# EAGLE board RK05ex6x10 (EAGLE 6.6.0), part 1 of 2
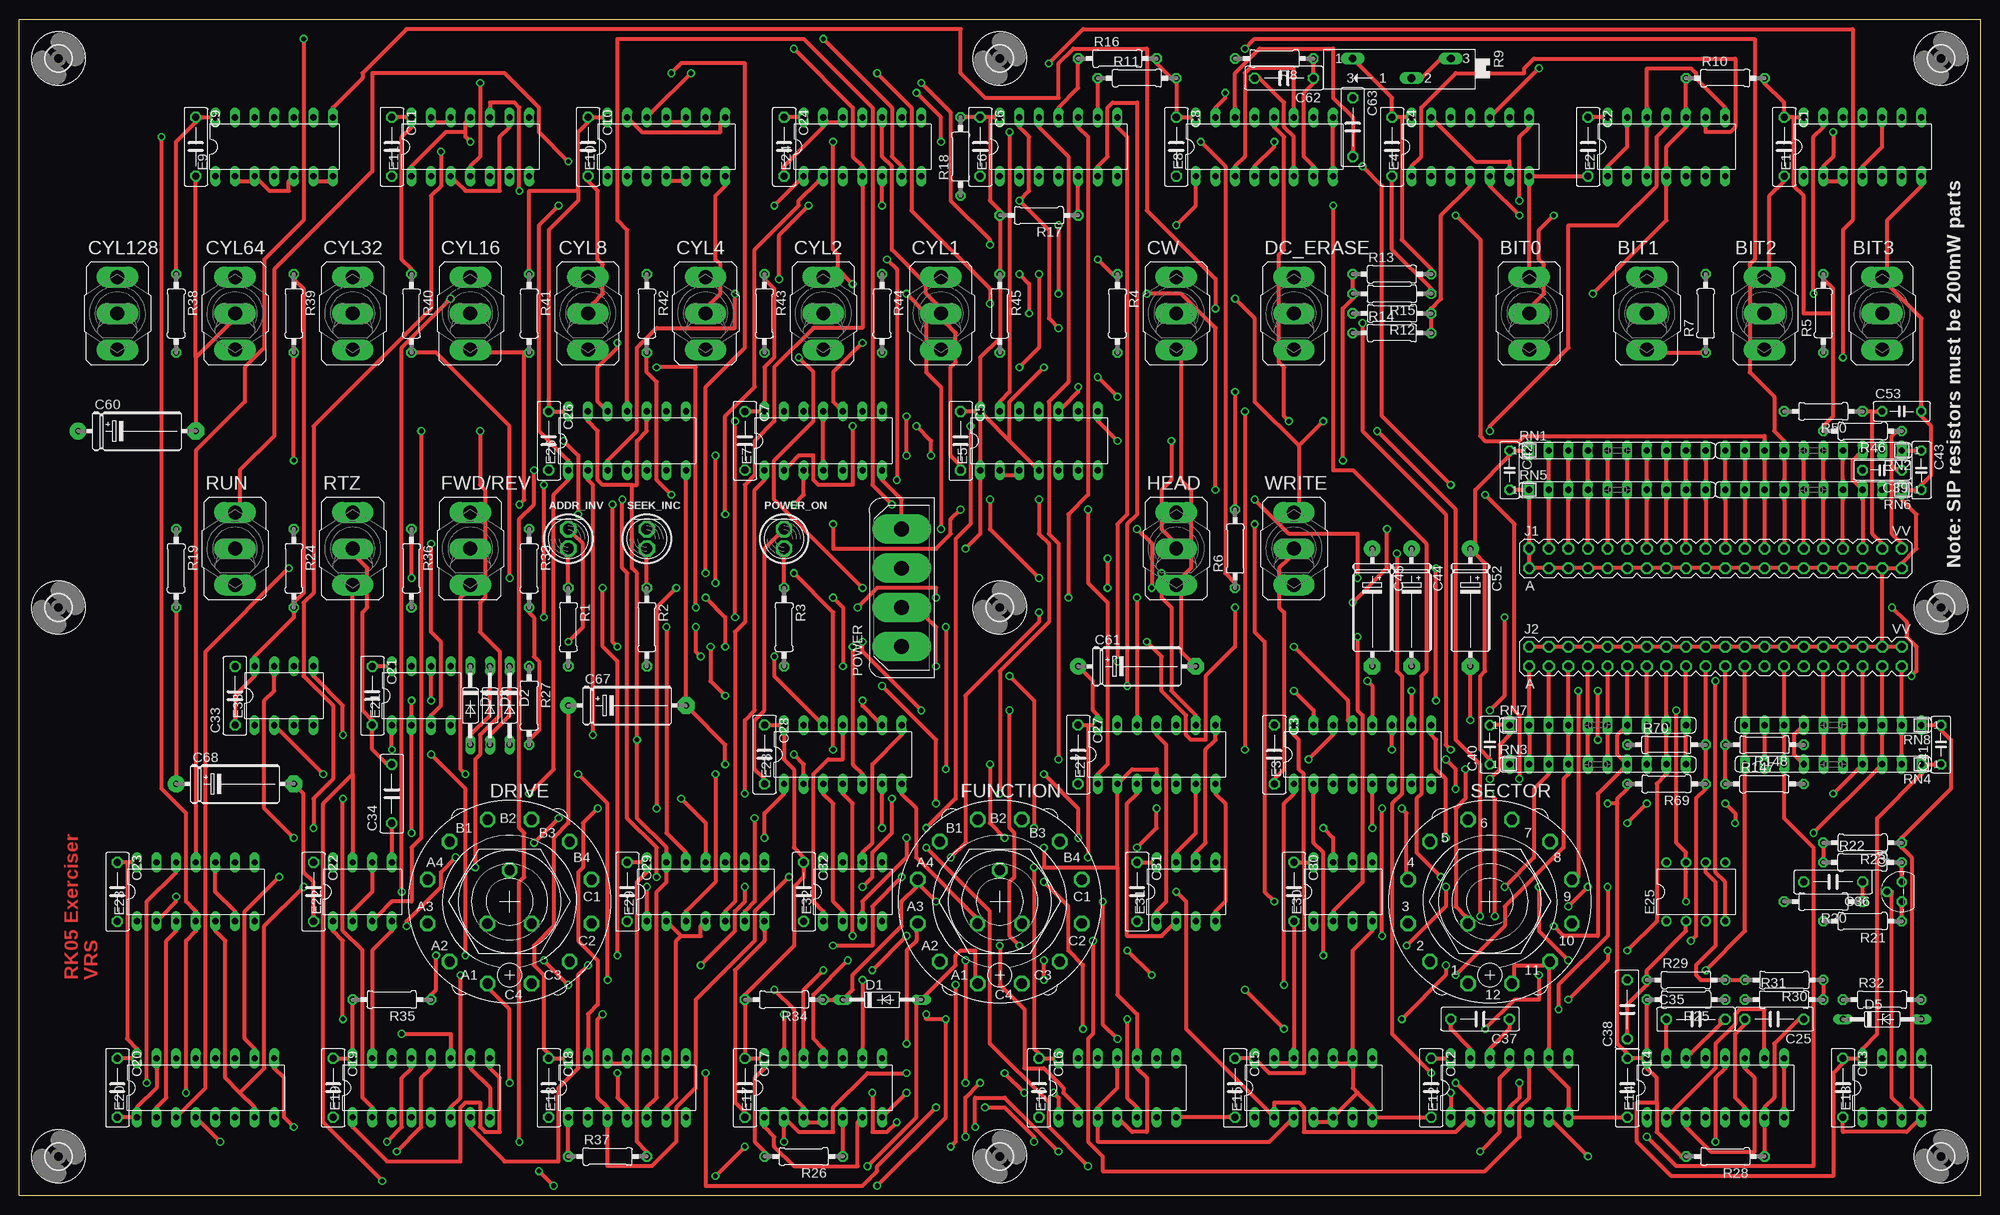
[diagram p5: board, top side]
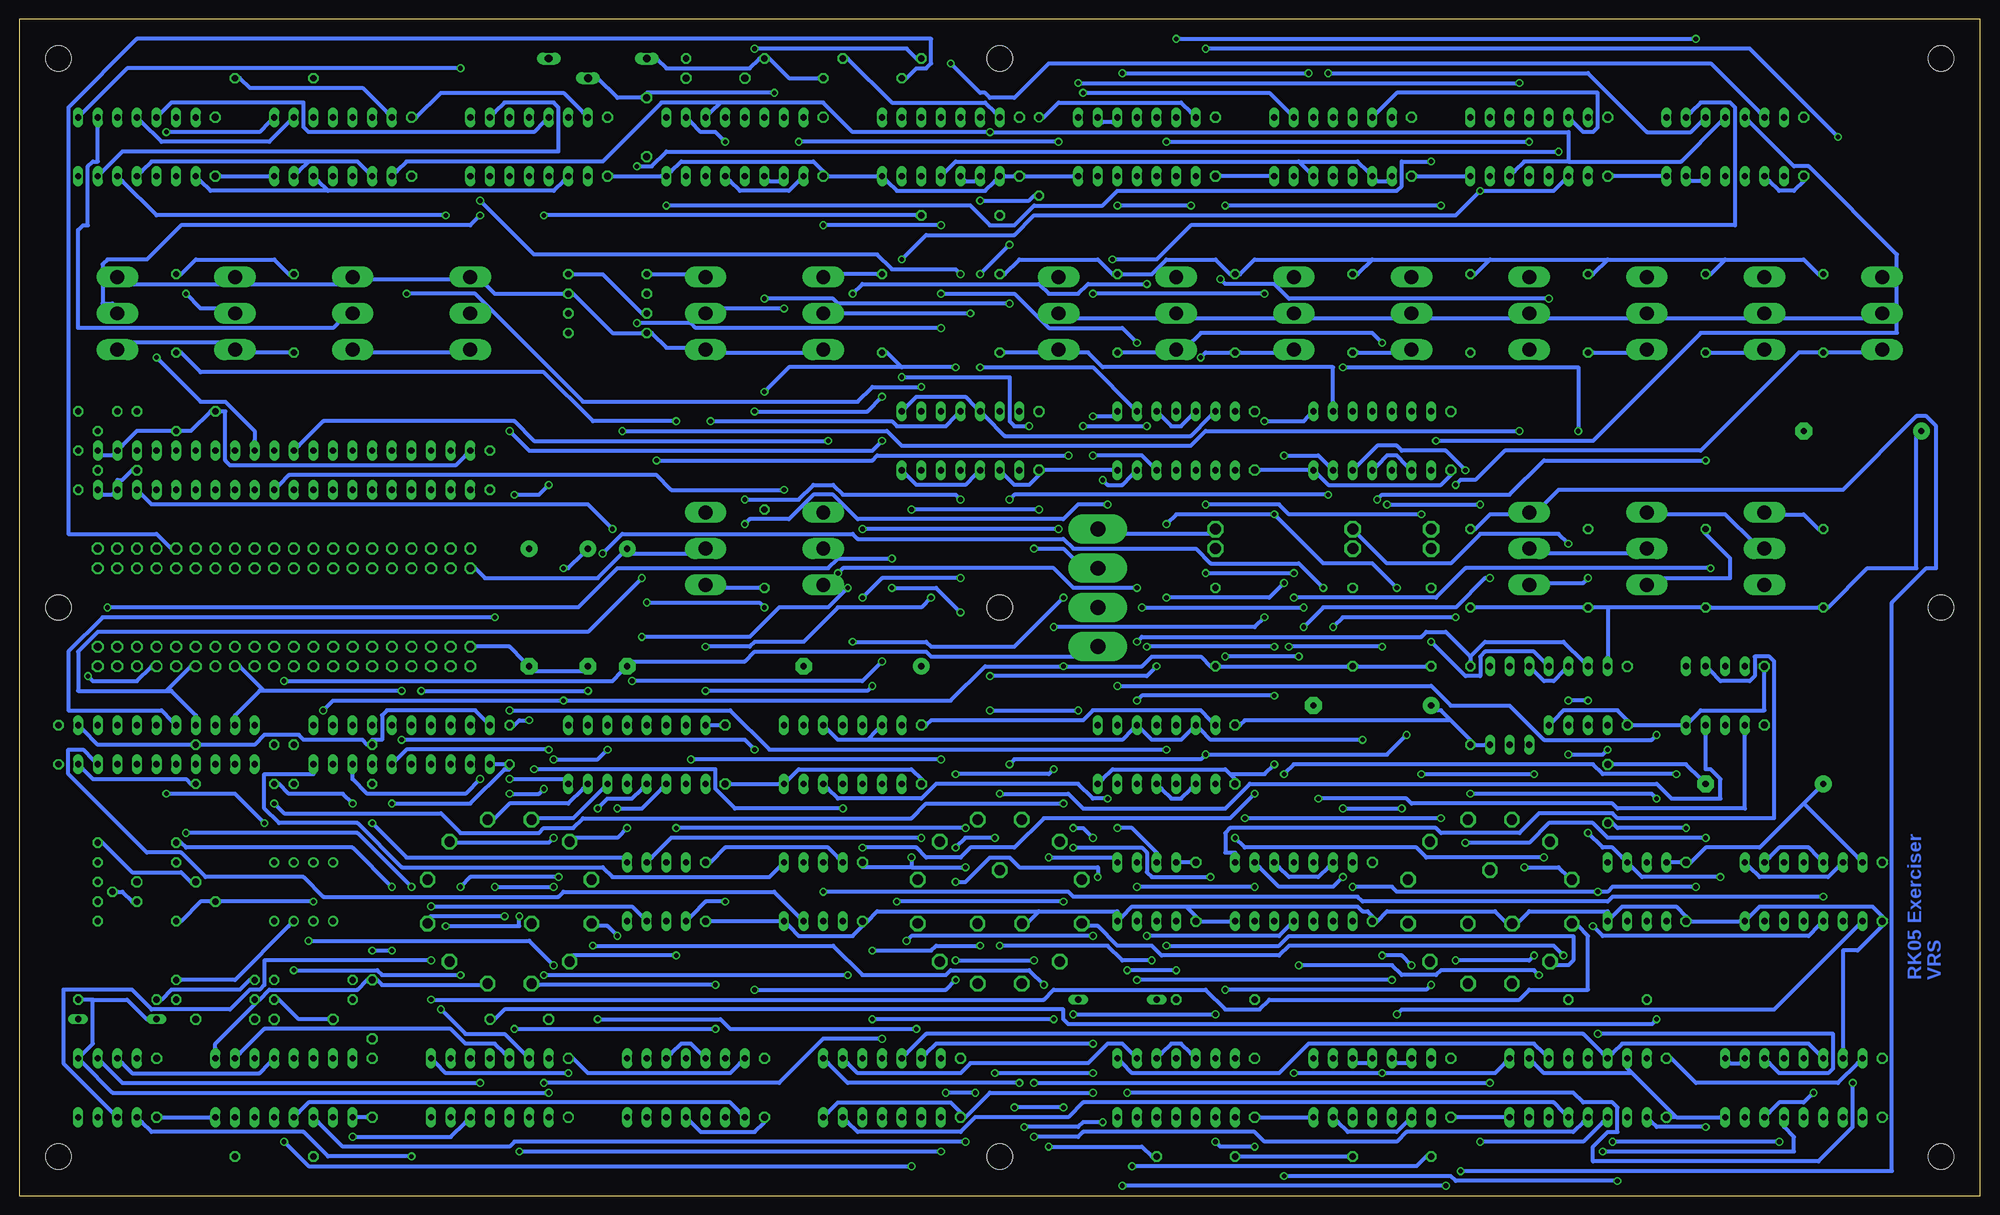
[diagram p6: board, bottom side, seen from below]

Size 254 x 152.4 mm. Coordinates in mm from the lower left corner, seen from the top.
Outline: 0,0 0,152.4 254,152.4 254,0 0,0
Copper layers (1*16): Top 0.035mm / dielectric 1.5mm / Bottom 0.035mm
Design rules "10mils *": minimum track width 10mil, minimum drill 24mil, track to track 10mil, track to pad 10mil, pad to pad 10mil, via to via 10mil, smd to smd 10mil, copper to edge 25mil, drill to drill 10mil, minimum pad ring 10mil, minimum via ring 8mil, stop-mask expansion 0mil, vias tented up to drill 0mil, thermal gap 10mil
Net classes: 0 default: width 0.508 mm, clearance 0.279 mm

## Footprints (pad centres in the part's own frame; a part is rotated, then mirrored left to right if it is on the bottom)
BULB = drill 1.422 octagon: A 0,0; B 0,2.54
M9040P = drill 1.803 long: 1 0,4.699; 2 0,0; 3 0,-4.699
C075-032X103 = drill 0.914 octagon: 1 -3.81,0; 2 3.81,0
C050-025X075 = drill 0.813 octagon: 1 -2.54,0; 2 2.54,0
E15-5 = drill 0.813 pad 2.159: + -7.62,0 | drill 0.813 pad 2.159 octagon: - 7.62,0
DO35-10 = drill 0.813 long: A 5.08,0; C -5.08,0
DO35Z10 = drill 0.813 long: A 5.08,0; C -5.08,0
CK103X04 = drill 1.321 octagon: A -2.87,-2.87; A1 -2.845,-10.617; A2 -7.772,-7.772; A3 -10.617,-2.845; A4 -10.617,2.845; B 0,4.059; B1 -7.772,7.772; B2 -2.845,10.617; B3 2.845,10.617; B4 7.772,7.772; C 2.87,-2.87; C1 10.617,2.845; C2 10.617,-2.845; C3 7.772,-7.772; C4 2.845,-10.617
DIL14 = drill 0.813 long: 1 -7.62,-3.81; 2 -5.08,-3.81; 3 -2.54,-3.81; 4 0,-3.81; 5 2.54,-3.81; 6 5.08,-3.81; 7 7.62,-3.81; 8 7.62,3.81; 9 5.08,3.81; 10 2.54,3.81; 11 0,3.81; 12 -2.54,3.81; 13 -5.08,3.81; 14 -7.62,3.81
DIL16 = drill 0.813 long: 1 -8.89,-3.81; 2 -6.35,-3.81; 3 -3.81,-3.81; 4 -1.27,-3.81; 5 1.27,-3.81; 6 3.81,-3.81; 7 6.35,-3.81; 8 8.89,-3.81; 9 8.89,3.81; 10 6.35,3.81; 11 3.81,3.81; 12 1.27,3.81; 13 -1.27,3.81; 14 -3.81,3.81; 15 -6.35,3.81; 16 -8.89,3.81
DIL08 = drill 0.813 long: 1 -3.81,-3.81; 2 -1.27,-3.81; 3 1.27,-3.81; 4 3.81,-3.81; 5 3.81,3.81; 6 1.27,3.81; 7 -1.27,3.81; 8 -3.81,3.81
DIL08' = drill 0.813 pad 1.27: 1 -3.81,-3.81; 2 -1.27,-3.81; 3 1.27,-3.81; 4 3.81,-3.81; 5 3.81,3.81; 6 1.27,3.81; 7 -1.27,3.81; 8 -3.81,3.81
DEC40PINV = drill 1.016 octagon: A -24.13,-1.27; AA 3.81,-1.27; B -24.13,1.27; BB 3.81,1.27; C -21.59,-1.27; CC 6.35,-1.27; D -21.59,1.27; DD 6.35,1.27; E -19.05,-1.27; EE 8.89,-1.27; F -19.05,1.27; FF 8.89,1.27; H -16.51,-1.27; HH 11.43,-1.27; J -16.51,1.27; JJ 11.43,1.27; K -13.97,-1.27; KK 13.97,-1.27; L -13.97,1.27; LL 13.97,1.27; M -11.43,-1.27; MM 16.51,-1.27; N -11.43,1.27; NN 16.51,1.27; P -8.89,-1.27; PP 19.05,-1.27; R -8.89,1.27; RR 19.05,1.27; S -6.35,-1.27; SS 21.59,-1.27; T -6.35,1.27; TT 21.59,1.27; U -3.81,-1.27; UU 24.13,-1.27; V -3.81,1.27; VV 24.13,1.27; W -1.27,-1.27; X -1.27,1.27; Y 1.27,-1.27; Z 1.27,1.27
FLOPPY-4 = drill 1.93 pad 3.81 long: 1 7.62,0; 2 2.54,0; 3 -2.54,0; 4 -7.62,0
TO92E = drill 0.813 octagon: B1 -1.27,0; B2 1.27,0; E 0,1.905
0207/10 = drill 0.813 octagon: 1 -5.08,0; 2 5.08,0
SP19L = drill 1.016 long: A 5.715,-1.27; E -6.985,-1.27; S -1.905,1.27
SIL10 = drill 0.813 long: 1 -11.43,0; 2 -8.89,0; 3 -6.35,0; 4 -3.81,0; 5 -1.27,0; 6 1.27,0; 7 3.81,0; 8 6.35,0; 9 8.89,0; 10 11.43,0
CK101X12 = drill 1.321 octagon: 1 -2.845,-10.617; 2 -7.772,-7.772; 3 -10.617,-2.845; 4 -10.617,2.845; 5 -7.772,7.772; 6 -2.845,10.617; 7 2.845,10.617; 8 7.772,7.772; 9 10.617,2.845; 10 10.617,-2.845; 11 7.772,-7.772; 12 2.845,-10.617; A -2.87,-2.87
3,3 = hole 3.3: 0,0

## Placement (x,y rotation side)
ADDR_INV  [BULB]  71.12,83.82 0 top
BIT0  [M9040P]  195.58,114.3 0 top
BIT1  [M9040P]  210.82,114.3 0 top
BIT2  [M9040P]  226.06,114.3 0 top
BIT3  [M9040P]  241.3,114.3 0 top
C1  .01uf  [C075-032X103]  228.6,135.89 270 top
C2  .01uf  [C075-032X103]  203.2,135.89 270 top
C3  .01uf  [C075-032X103]  162.56,57.15 270 top
C4  .01uf  [C075-032X103]  177.8,135.89 270 top
C5  .01uf  [C075-032X103]  121.92,97.79 270 top
C6  .01uf  [C075-032X103]  124.46,135.89 270 top
C7  .01uf  [C075-032X103]  93.98,97.79 270 top
C8  .01uf  [C075-032X103]  149.86,135.89 270 top
C9  .01uf  [C075-032X103]  22.86,135.89 270 top
C10  .01uf  [C075-032X103]  73.66,135.89 270 top
C11  .01uf  [C075-032X103]  48.26,135.89 270 top
C12  .01uf  [C075-032X103]  182.88,13.97 270 top
C13  .01uf  [C075-032X103]  236.22,13.97 270 top
C14  .01uf  [C075-032X103]  208.28,13.97 270 top
C15  .01uf  [C075-032X103]  157.48,13.97 270 top
C16  .01uf  [C075-032X103]  132.08,13.97 270 top
C17  .01uf  [C075-032X103]  93.98,13.97 270 top
C18  .01uf  [C075-032X103]  68.58,13.97 270 top
C19  .01uf  [C075-032X103]  40.64,13.97 270 top
C20  .01uf  [C075-032X103]  12.7,13.97 270 top
C21  .01uf  [C075-032X103]  45.72,64.77 270 top
C22  .01uf  [C075-032X103]  38.1,39.37 270 top
C23  .01uf  [C075-032X103]  12.7,39.37 270 top
C24  .01uf  [C075-032X103]  99.06,135.89 270 top
C25  470pf  [C075-032X103]  227.33,22.86 180 top
C26  .01uf  [C075-032X103]  68.58,97.79 270 top
C27  .01uf  [C075-032X103]  137.16,57.15 270 top
C28  .01uf  [C075-032X103]  96.52,57.15 270 top
C29  .01uf  [C075-032X103]  78.74,39.37 270 top
C30  .01uf  [C075-032X103]  165.1,39.37 270 top
C31  .01uf  [C075-032X103]  144.78,39.37 270 top
C32  .01uf  [C075-032X103]  101.6,39.37 270 top
C33  .01uf  [C075-032X103]  27.94,64.77 90 top
C34  .001uf  [C075-032X103]  48.26,52.07 90 top
C35  470pf  [C075-032X103]  217.17,22.86 0 top
C36  .033uf  [C075-032X103]  234.95,40.64 180 top
C37  .001uf  [C075-032X103]  189.23,22.86 180 top
C38  100pf  [C075-032X103]  208.28,24.13 90 top
C39  .001  [C050-025X075]  241.3,93.98 180 top
C40  .22uf  [C050-025X075]  190.5,58.42 90 top
C41  .22uf  [C050-025X075]  248.92,58.42 90 top
C42  .22uf  [C050-025X075]  193.04,93.98 270 top
C43  .22uf  [C050-025X075]  246.38,93.98 270 top
C44  6.8uf  [E15-5]  180.34,76.2 270 top
C45  6.8uf  [E15-5]  175.26,76.2 270 top
C52  39uf  [E15-5]  187.96,76.2 270 top
C53  .001  [C050-025X075]  243.84,101.6 0 top
C60  6.8uf  [E15-5]  15.24,99.06 0 top
C61  6.8uf  [E15-5]  144.78,68.58 0 top
C62  27pf  [C075-032X103]  163.83,144.78 180 top
C63  47pf  [C075-032X103]  172.72,138.43 270 top
C67  6.8uf  [E15-5]  78.74,63.5 0 top
C68  6.8uf  [E15-5]  27.94,53.34 0 top
CW  [M9040P]  149.86,114.3 0 top
CYL1  [M9040P]  119.38,114.3 0 top
CYL2  [M9040P]  104.14,114.3 0 top
CYL4  [M9040P]  88.9,114.3 0 top
CYL8  [M9040P]  73.66,114.3 0 top
CYL16  [M9040P]  58.42,114.3 0 top
CYL32  [M9040P]  43.18,114.3 0 top
CYL64  [M9040P]  27.94,114.3 0 top
CYL128  [M9040P]  12.7,114.3 0 top
D1  D664  [DO35-10]  111.76,25.4 0 top
D2  D664  [DO35-10]  63.5,63.5 270 top
D3  D664  [DO35-10]  60.96,63.5 270 top
D4  D664  [DO35-10]  58.42,63.5 270 top
D5  1N746  [DO35Z10]  241.3,22.86 0 top
DC_ERASE  [M9040P]  165.1,114.3 0 top
DRIVE  [CK103X04]  63.5,38.1 0 top
E1  74LS10N  [DIL14]  238.76,135.89 0 top
E2  74LS74N  [DIL14]  213.36,135.89 0 top
E3  74LS42N  [DIL16]  173.99,57.15 0 top
E4  74LS20N  [DIL14]  187.96,135.89 0 top
E5  74LS74N  [DIL14]  132.08,97.79 0 top
E6  74LS04N  [DIL14]  134.62,135.89 0 top
E7  74LS00N  [DIL14]  104.14,97.79 0 top
E8  74123N  [DIL16]  161.29,135.89 0 top
E9  N8881N  [DIL14]  33.02,135.89 0 top
E10  74LS00N  [DIL14]  83.82,135.89 0 top
E11  74LS74N  [DIL14]  58.42,135.89 0 top
E12  74LS04N  [DIL14]  193.04,13.97 0 top
E13  DS75451N  [DIL08]  242.57,13.97 0 top
E14  74LS123N  [DIL16]  219.71,13.97 0 top
E15  74LS00N  [DIL14]  167.64,13.97 0 top
E16  74LS10N  [DIL14]  142.24,13.97 0 top
E17  74LS00N  [DIL14]  104.14,13.97 0 top
E18  74LS74N  [DIL14]  78.74,13.97 0 top
E19  74LS193N  [DIL16]  52.07,13.97 0 top
E20  74LS193N  [DIL16]  24.13,13.97 0 top
E21  DS75451N  [DIL08]  52.07,64.77 0 top
E22  DS75451N  [DIL08]  44.45,39.37 0 top
E23  74LS10N  [DIL14]  22.86,39.37 0 top
E24  74LS20N  [DIL14]  109.22,135.89 0 top
E25  LM741P  [DIL08']  217.17,39.37 0 top
E26  74LS00N  [DIL14]  78.74,97.79 0 top
E27  74LS00N  [DIL14]  147.32,57.15 0 top
E28  74LS00N  [DIL14]  106.68,57.15 0 top
E29  74LS00N  [DIL14]  88.9,39.37 0 top
E30  DS75451N  [DIL08]  171.45,39.37 0 top
E31  DS75451N  [DIL08]  151.13,39.37 0 top
E32  DS75451N  [DIL08]  107.95,39.37 0 top
E33  DS75451N  [DIL08]  34.29,64.77 0 top
FUNCTION  [CK103X04]  127,38.1 0 top
FWD/REV  [M9040P]  58.42,83.82 0 top
HEAD  [M9040P]  149.86,83.82 0 top
J1  DEC40PINSV  [DEC40PINV]  219.71,82.55 0 top
J2  DEC40PINSV  [DEC40PINV]  219.71,69.85 0 top
POWER  [FLOPPY-4]  114.3,78.74 90 top
POWER_ON  [BULB]  99.06,83.82 0 top
Q1  2N4894  [TO92E]  243.84,39.37 90 top
R1  0ohm  [0207/10]  71.12,73.66 270 top
R2  0ohm  [0207/10]  81.28,73.66 270 top
R3  0ohm  [0207/10]  99.06,73.66 270 top
R4  1K  [0207/10]  142.24,114.3 270 top
R5  56K  [0207/10]  233.68,114.3 90 top
R6  56K  [0207/10]  157.48,83.82 90 top
R7  1K  [0207/10]  218.44,114.3 90 top
R8  5.6k  [0207/10]  162.56,147.32 180 top
R9  10K  [SP19L]  178.44,146.05 180 top
R10  1K  [0207/10]  220.98,144.78 0 top
R11  1K  [0207/10]  144.78,144.78 0 top
R12  330  [0207/10]  177.8,114.3 180 top
R13  330  [0207/10]  177.8,119.38 0 top
R14  750  [0207/10]  177.8,111.76 0 top
R15  750  [0207/10]  177.8,116.84 180 top
R16  1K  [0207/10]  142.24,147.32 0 top
R17  1K  [0207/10]  132.08,127 180 top
R18  1K  [0207/10]  121.92,134.62 90 top
R19  1K  [0207/10]  20.32,81.28 270 top
R20  470K  [0207/10]  233.68,38.1 180 top
R21  330  [0207/10]  238.76,35.56 180 top
R22  120  [0207/10]  238.76,43.18 0 top
R23  68  [0207/10]  238.76,45.72 180 top
R24  1K  [0207/10]  35.56,81.28 270 top
R25  10K  [0207/10]  215.9,25.4 180 top
R26  1K  [0207/10]  101.6,5.08 180 top
R27  1K  [0207/10]  66.04,63.5 270 top
R28  22K  [0207/10]  220.98,5.08 180 top
R29  100K  [0207/10]  215.9,27.94 0 top
R30  100K  [0207/10]  228.6,27.94 180 top
R31  1M  [0207/10]  228.6,25.4 0 top
R32  1K  [0207/10]  241.3,25.4 0 top
R33  1K  [0207/10]  66.04,81.28 270 top
R34  1K  [0207/10]  99.06,25.4 180 top
R35  1K  [0207/10]  48.26,25.4 180 top
R36  1K  [0207/10]  50.8,81.28 270 top
R37  1K  [0207/10]  76.2,5.08 0 top
R38  1K  [0207/10]  20.32,114.3 270 top
R39  1K  [0207/10]  35.56,114.3 270 top
R40  1K  [0207/10]  50.8,114.3 270 top
R41  1K  [0207/10]  66.04,114.3 270 top
R42  1K  [0207/10]  81.28,114.3 270 top
R43  1K  [0207/10]  96.52,114.3 270 top
R44  1K  [0207/10]  111.76,114.3 270 top
R45  1K  [0207/10]  127,114.3 270 top
R46  390  [0207/10]  238.76,99.06 180 top
R50  390  [0207/10]  233.68,101.6 180 top
R69  180  [0207/10]  213.36,53.34 180 top
R70  390  [0207/10]  213.36,58.42 0 top
R147  180  [0207/10]  226.06,53.34 0 top
R148  390  [0207/10]  226.06,58.42 180 top
RN1  180  [SIL10]  207.01,96.52 0 top
RN2  180  [SIL10]  232.41,96.52 180 top
RN3  180  [SIL10]  204.47,55.88 0 top
RN4  180  [SIL10]  234.95,55.88 180 top
RN5  390  [SIL10]  207.01,91.44 0 top
RN6  390  [SIL10]  232.41,91.44 180 top
RN7  390  [SIL10]  204.47,60.96 0 top
RN8  390  [SIL10]  234.95,60.96 180 top
RTZ  [M9040P]  43.18,83.82 0 top
RUN  [M9040P]  27.94,83.82 0 top
SECTOR  [CK101X12]  190.5,38.1 0 top
SEEK_INC  [BULB]  81.28,83.82 0 top
U$1  [3,3]  5.08,147.32 0 top
U$2  [3,3]  5.08,5.08 0 top
U$3  [3,3]  5.08,76.2 0 top
U$4  [3,3]  248.92,147.32 0 top
U$5  [3,3]  248.92,5.08 0 top
U$6  [3,3]  248.92,76.2 0 top
U$7  [3,3]  127,147.32 0 top
U$8  [3,3]  127,5.08 0 top
U$9  [3,3]  127,76.2 0 top
WRITE  MOM  [M9040P]  165.1,83.82 0 top

## Tracks (layer width: path | path; a pad name or v marks a point on that pad's centre or on a via)
0BIT
  Bottom 0.508: E4.9 192.41,140.34 191.13,141.6 184.78,141.6 184.15,140.97 184.15,135.25 240.66,135.25 243.21,132.72 E1.6
1.44MHZ  (via drill 0.61)
  Top 0.508: v164.47,100.33 163.83,100.97 163.83,107.31 163.19,107.95 163.19,121.92 163.83,122.56 163.83,137.16 162.56,138.43 E8.12
  Bottom 0.508: v164.47,100.33 140.97,100.33 140.34,99.69 133.99,99.69 132.72,100.97 E5.11
1BIT  (via drill 0.61)
  Top 0.508: v196.85,146.05 191.13,140.34 E4.10
  Bottom 0.508: v196.85,146.05 240.03,146.05 245.75,140.34 E1.8
1L  (via drill 0.61)
  Top 0.508: v190.5,99.06 190.5,99.69 200.66,109.86 200.66,125.73 207.01,125.73 212.09,130.81 212.09,137.16 213.36,138.43 E2.11 | v142.24,97.79 139.7,100.33 E5.8
  Bottom 0.508: E7.13 99.69,100.97 102.23,98.42 126.36,98.42 128.91,100.97 E5.12 130.18,102.23 131.44,103.5 137.79,103.5 139.06,102.23 E5.8 | v190.5,99.06 187.96,96.52 143.51,96.52 v142.24,97.79
2.88MHZ  (via drill 0.61)
  Top 0.508: v162.56,136.53 162.56,135.89 160.02,133.35 E8.4
  Bottom 0.508: v162.56,136.53 163.83,137.79 165.74,137.79 167,139.06 E8.10
2BIT
  Bottom 0.508: E4.12 186.06,139.06 187.32,137.79 216.53,137.79 217.17,138.43 217.17,141.6 234.31,141.6 235.59,140.34 E1.12
2H
  Top 0.508: E4.1 180.34,133.35 181.61,134.62 181.61,140.97 186.06,145.41 194.94,145.41 194.94,146.05 196.22,147.32 222.25,147.32 222.25,138.43 221.62,137.79 218.44,137.79 218.44,138.43 E2.9
  Bottom 0.508: E1.11 238.12,139.06 235.59,136.53 221.62,136.53 219.07,139.06 E2.9
2L  (via drill 0.61)
  Top 0.508: E1.3 235.59,131.44 234.31,131.44 E1.2 233.68,133.35 234.95,134.62 v234.95,137.79 | E2.3 210.82,133.35 210.82,138.43 E2.12 210.82,140.97 210.82,146.05 216.53,146.05 217.17,145.41 217.17,144.78 220.98,140.97 E2.8
  Bottom 0.508: v234.95,137.79 222.88,137.79 221.62,139.06 E2.8
3BIT
  Top 0.508: E4.13 183.51,139.06 188.59,133.99 193.04,133.99 193.04,133.35 E4.6
4H
  Bottom 0.508: 214,130.18 184.78,130.18 183.51,131.44 E4.2 | 214,130.18 215.26,131.44 E2.5 | 214,130.18 229.24,130.18 230.5,131.44 E1.1
4L
  Top 0.508: E1.4 238.76,133.35 241.3,135.89 241.3,138.43 E1.10
  Bottom 0.508: 216.53,133.99 210.19,133.99 208.91,132.72 E2.2 | 216.53,133.99 217.81,132.72 E2.6 | 216.53,133.99 236.85,133.99 238.12,132.72 E1.4
202_DETECT_L  (via drill 0.61)
  Top 0.508: v36.83,149.86 36.83,126.36 31.75,121.28 31.75,109.86 29.21,107.31 29.21,102.87 22.86,96.52 22.86,44.45 E23.11 | v104.14,149.86 113.03,140.97 113.03,134.62 114.3,133.35 E24.6
  Bottom 0.508: v104.14,149.86 v36.83,149.86
+3V  (via drill 0.61)
  Top 0.508: E22.2 43.18,36.83 45.72,39.37 45.72,41.91 E22.6 | v50.8,46.99 50.8,59.69 E21.2 50.8,62.23 v50.8,64.14 | v53.34,64.14 53.34,67.31 E21.6 | v35.56,8.89 34.29,10.16 34.29,15.24 33.02,16.51 E20.9 | E14.3 215.9,8.89 219.07,5.71 224.79,5.71 224.79,15.24 223.52,16.51 E14.11 | v77.47,15.88 77.47,12.7 78.74,11.43 E18.4 | v131.44,6.99 131.44,7.62 127.64,11.43 v125.09,11.43 | v118.75,11.43 111.12,3.81 111.12,3.17 109.22,1.27 88.9,1.27 v88.9,15.88 | E19.1 43.18,8.89 47.62,4.45 57.15,4.45 57.15,11.43 57.78,12.06 59.69,12.06 59.69,8.89 60.33,8.26 62.23,8.26 62.23,15.24 60.96,16.51 E19.9 | v33.66,41.27 29.21,36.83 29.21,20.32 30.48,19.05 E20.10
  Bottom 0.508: E21.6 53.98,67.94 55.24,66.67 56.52,66.67 57.78,67.94 D4.C | v50.8,46.99 48.9,45.09 47.62,45.09 46.35,43.81 E22.6 45.09,42.55 43.81,41.27 v33.66,41.27 | v50.8,64.14 v53.34,64.14 | v35.56,8.89 41.91,8.89 42.55,9.53 E19.1 | E20.10 31.11,17.14 32.38,17.14 E20.9 | E19.9 61.59,17.14 62.87,15.88 v77.47,15.88 v88.9,15.88 | v131.44,6.99 189.87,6.99 190.5,6.35 212.09,6.35 215.26,9.53 E14.3 | v118.75,11.43 v125.09,11.43
+3VA  (via drill 0.61)
  Top 0.508: v107.95,99.69 107.95,92.08 103.5,92.08 102.87,92.71 102.87,95.89 100.97,95.89 99.69,94.61 E7.2 | v116.2,99.69 118.11,97.79 v118.11,95.89 | v171.45,95.25 171.45,114.94 172.72,116.2 R15.2 172.72,117.47 172.72,118.75 R13.1
  Bottom 0.508: v116.2,99.69 v107.95,99.69 | v118.11,95.89 142.88,95.89 143.51,95.25 v171.45,95.25 | DC_ERASE.1 166.37,119.38 172.09,119.38 R13.1
+3VB
  Top 0.508: R14.2 182.88,112.39 182.88,113.67 R12.1 182.88,114.94 184.15,116.2 184.15,127 187.96,130.81 E4.4
+3VC  (via drill 0.61)
  Top 0.508: v64.77,130.18 64.77,140.97 64.14,141.6 60.96,141.6 60.96,140.97 E11.10 | v139.7,121.28 141.6,119.38 R4.1
  Bottom 0.508: R4.1 142.88,119.38 148.59,119.38 CW.1 | E11.2 53.98,131.44 55.24,130.18 v64.77,130.18 67.94,127 122.56,127 125.09,124.46 136.53,124.46 v139.7,121.28
+15V  (via drill 0.61)
  Top 0.508: v215.9,38.1 215.9,41.91 E25.7 215.9,44.45 214.63,45.72 v214.63,62.87 | v183.51,64.14 v183.51,81.28 | v118.75,68.58 118.75,73.66 117.47,74.93 POWER.3
  Bottom 0.508: v215.9,38.1 227.97,38.1 R20.2 229.24,38.1 230.5,38.1 233.04,35.56 R21.2 | R1.2 71.75,68.58 80.64,68.58 R2.2 81.92,68.58 98.42,68.58 R3.2 99.69,68.58 100.97,69.85 107.31,69.85 108.58,68.58 v118.75,68.58 128.91,68.58 133.35,64.14 v183.51,64.14 213.36,64.14 v214.63,62.87 | v183.51,81.28 182.88,81.28 180.97,83.19 C44.+
-15V  (via drill 0.61)
  Top 0.508: v219.71,66.67 219.71,41.91 220.98,40.64 220.98,36.83 E25.4
  Bottom 0.508: v219.71,66.67 177.16,66.67 175.9,67.94 C45.- 174.62,69.22 160.02,69.22 158.75,70.48 136.53,70.48 135.89,69.85 117.47,69.85 POWER.4
ADDR_COUNTER_1  (via drill 0.61)
  Top 0.508: v64.77,6.99 64.77,40.64 65.41,41.27 65.41,46.99 64.77,47.62 64.77,87.63 66.67,89.53 v66.67,93.98
  Bottom 0.508: v64.77,6.99 51.44,6.99 48.9,9.53 E19.3 | v66.67,93.98 69.22,96.52 74.93,96.52 75.56,97.16 78.11,97.16 80.64,94.61 E26.5
ADDR_COUNTER_2  (via drill 0.61)
  Top 0.508: v41.91,51.44 41.91,34.29 44.45,31.75 44.45,12.7 45.72,11.43 E19.2 | v66.04,52.07 69.22,55.24 69.22,90.81 71.12,92.71 E26.1 71.12,95.25 67.31,99.06 67.31,125.73 v69.85,128.27 | v97.79,128.27 100.97,131.44 E24.1
  Bottom 0.508: v41.91,51.44 42.55,52.07 v66.04,52.07 | v69.85,128.27 v97.79,128.27
ADDR_COUNTER_4  (via drill 0.61)
  Top 0.508: v57.15,28.57 57.15,12.7 55.88,11.43 E19.6 | v88.27,29.84 92.71,34.29 92.71,36.83 93.98,38.1 v93.98,40.01 | v109.22,40.01 110.49,41.27 110.49,44.45 113.03,46.99 v113.03,51.44
  Bottom 0.508: v57.15,28.57 57.78,29.21 69.85,29.21 70.48,28.57 74.93,28.57 76.2,29.84 v88.27,29.84 | v93.98,40.01 v109.22,40.01 | v113.03,51.44 114.94,51.44 116.84,53.34 135.25,53.34 137.16,51.44 147.96,51.44 149.22,52.7 E27.5
ADDR_COUNTER_8  (via drill 0.61)
  Top 0.508: v73.66,29.84 72.39,28.57 72.39,16.51 69.85,13.97 69.85,4.45 62.87,4.45 58.42,8.89 E19.7 | v77.47,31.11 77.47,69.22 75.56,71.12 v75.56,78.74 | v91.44,88.27 91.44,100.97 95.25,104.78 95.25,122.56 100.97,128.27 100.97,128.91 103.5,131.44 E24.2 | v138.43,88.9 138.43,79.38 140.97,76.83 140.97,55.88 139.7,54.61 E27.1 | v121.92,88.9 120.65,87.63 120.65,85.72 118.75,83.82 105.41,83.82 v105.41,87
  Bottom 0.508: v73.66,29.84 74.93,31.11 v77.47,31.11 | v75.56,78.74 78.74,81.92 85.09,81.92 v91.44,88.27 104.14,88.27 v105.41,87 | v121.92,88.9 v138.43,88.9
ADDR_COUNTER_16  (via drill 0.61)
  Top 0.508: v34.92,81.28 24.13,70.48 24.13,13.97 20.95,10.79 E20.3 | v88.9,77.47 91.44,74.93 v91.44,71.12 | v107.95,71.12 107.95,55.88 109.22,54.61 E28.5
  Bottom 0.508: v34.92,81.28 66.67,81.28 70.48,77.47 v88.9,77.47 | v91.44,71.12 v107.95,71.12
ADDR_COUNTER_32  (via drill 0.61)
  Top 0.508: E20.2 17.78,11.43 19.05,12.7 19.05,33.02 20.32,34.29 E23.3 | v96.52,46.35 96.52,49.53 99.06,52.07 E28.1 | v56.52,43.81 54.61,41.91 54.61,40.01 50.16,35.56 v50.16,34.92
  Bottom 0.508: v96.52,46.35 95.25,45.09 73.03,45.09 71.75,43.81 v56.52,43.81 | v50.16,34.92 48.9,33.66 22.23,33.66 20.95,34.92 E23.3
ADDR_COUNTER_64  (via drill 0.61)
  Top 0.508: v21.59,13.34 21.59,33.02 22.86,34.29 E23.4 22.86,36.83 21.59,38.1 21.59,49.53 18.41,52.7 v18.41,137.16 | E29.5 91.44,36.83 92.71,38.1 92.71,73.03 93.98,74.3 93.98,92.08 95.25,93.34 95.25,97.79 97.79,100.33 97.79,107.31 102.87,112.39 109.22,112.39 109.22,130.81 E24.4 109.22,133.35 107.95,134.62 107.95,140.97 v100.33,148.59
  Bottom 0.508: v21.59,13.34 22.86,12.06 26.04,12.06 27.3,10.79 E20.6 | v18.41,137.16 29.84,148.59 v100.33,148.59
ADDR_COUNTER_128  (via drill 0.61)
  Top 0.508: 28.57,13.34 26.67,15.24 26.67,33.02 25.4,34.29 E23.5 | 28.57,13.34 30.48,11.43 E20.7 | v81.28,40.01 81.28,36.83 E29.1 | v36.83,40.01 31.75,34.92 31.75,16.51 28.57,13.34 | v111.76,128.27 111.76,130.81 E24.5 | v102.23,128.27 98.42,124.46 v98.42,118.75 | v55.88,116.2 49.53,109.86 v49.53,39.37
  Bottom 0.508: v81.28,40.01 76.2,40.01 75.56,39.37 v49.53,39.37 48.26,39.37 47.62,40.01 v36.83,40.01 | v102.23,128.27 v111.76,128.27 | v98.42,118.75 97.79,118.11 91.44,118.11 89.53,116.2 v55.88,116.2
ADDR_SOURCE_H  (via drill 0.61)
  Top 0.508: 79.38,92.08 80.01,92.08 80.01,97.79 81.28,99.06 81.28,100.33 E26.10 | 79.38,92.08 75.56,92.08 74.93,92.71 74.93,99.06 73.66,100.33 E26.13 | E18.5 81.28,11.43 82.55,12.7 82.55,39.37 83.82,40.64 83.82,41.91 E29.13 83.82,44.45 83.82,45.09 80.01,48.9 v80.01,59.05 80.01,80.64 79.38,81.28 79.38,92.08
  Bottom 0.508: 144.15,59.05 142.88,60.33 E27.13 | 144.15,59.05 147.96,59.05 149.22,60.33 E27.10 | 144.15,59.05 111.12,59.05 109.86,60.33 E28.10 108.58,60.33 107.31,59.05 103.5,59.05 102.23,60.33 E28.13 100.97,60.33 99.69,59.05 v80.01,59.05 | E29.10 90.81,42.55 89.53,41.27 85.72,41.27 84.45,42.55 E29.13
ADDR_SOURCE_L  (via drill 0.61)
  Top 0.508: E27.4 147.32,54.61 147.32,55.24 144.15,55.24 142.88,53.98 E27.2 142.24,52.07 142.24,42.55 | E16.4 142.88,9.53 144.15,8.26 146.05,8.26 146.05,15.24 144.78,16.51 E16.10 144.78,19.05 144.78,23.5 142.24,26.04 142.24,42.55 | 85.72,33.66 84.45,34.92 E29.2 | 85.72,33.66 88.27,33.66 88.27,34.92 E29.4 | 85.72,33.66 85.09,33.02 85.09,12.7 83.82,11.43 E18.6 | v107.95,33.66 107.95,50.8 106.68,52.07 E28.4 | v74.3,59.69 74.3,92.08 73.66,92.71 E26.2 | v100.33,57.15 101.6,55.88 101.6,54.61 E28.2 | 142.24,42.55 132.72,42.55 v132.72,45.09 | v127.64,46.35 125.73,48.26 v125.73,55.88
  Bottom 0.508: E26.2 74.3,94.61 75.56,95.89 76.83,95.89 78.11,94.61 E26.4 | E28.2 102.23,52.7 103.5,51.44 104.78,51.44 106.05,52.7 E28.4 | E18.2 74.3,9.53 75.56,8.26 81.92,8.26 83.19,9.53 E18.6 | v107.95,33.66 90.81,33.66 89.53,34.92 E29.4 | v74.3,59.69 76.83,57.15 v100.33,57.15 100.97,56.52 125.09,56.52 v125.73,55.88 | v132.72,45.09 131.44,46.35 v127.64,46.35
ADDRESS_INVALID_L  (via drill 0.61)
  Top 0.508: v71.12,71.75 73.03,73.66 73.03,84.45 71.75,85.72 ADDR_INV.B
  Bottom 0.508: v71.12,71.75 66.67,67.31 64.77,67.31 64.77,69.85 64.14,70.48 57.78,70.48 56.52,69.22 E21.5
BIT_0L  (via drill 0.61)
  Top 0.508: v198.75,127 196.85,125.09 196.85,121.28 197.49,120.65 197.49,116.84 196.22,115.57 BIT0.2
  Bottom 0.508: v198.75,127 236.22,127 240.66,131.44 E1.5
BIT_1L
  Bottom 0.508: E1.9 243.84,138.43 243.84,133.99 244.47,133.99 245.11,133.35 245.11,125.73 245.75,125.73 246.38,125.09 246.38,112.39 213.36,112.39 212.09,113.67 BIT1.2
BIT_2L  (via drill 0.61)
  Top 0.508: v232.41,116.84 232.41,137.16 233.68,138.43 E1.13
  Bottom 0.508: v232.41,116.84 230.5,114.94 227.33,114.94 BIT2.2
BIT_3L  (via drill 0.61)
  Top 0.508: v194.31,127 190.5,130.81 E4.5
  Bottom 0.508: v194.31,127 195.58,125.73 233.04,125.73 237.49,121.28 242.57,121.28 243.21,120.65 243.21,115.57 241.94,115.57 BIT3.2
BUS_AC_LO_L
  Top 0.508: 242.57,94.61 243.21,93.98 C39.1 | 242.57,94.61 242.57,98.42 243.21,99.06 R46.1 | 242.57,94.61 242.57,85.72 243.84,84.45 J1.VV
BUS_ADDR_ACCEPTED_L
  Top 0.508: RN3.5 203.2,57.15 203.2,59.69 RN7.5 203.2,62.23 203.2,67.94 J2.H
BUS_ADDRESS_INVALID_L  (via drill 0.61)
  Top 0.508: R26.1 106.68,5.71 106.68,8.89 E17.5 | J2.C 198.12,67.94 198.12,62.23 RN7.3 198.12,59.69 198.12,57.15 RN3.3 198.12,54.61 196.22,52.7 196.22,43.81 v192.41,40.01 | v120.65,6.35 121.28,6.99 v121.28,27.3 | v179.71,32.38 184.78,37.47 v184.78,40.01
  Bottom 0.508: v120.65,6.35 108.58,6.35 107.31,5.08 R26.1 | v121.28,27.3 123.19,29.21 133.35,29.21 133.99,28.57 144.78,28.57 148.59,32.38 v179.71,32.38 | v192.41,40.01 v184.78,40.01
BUS_CA_00_L  (via drill 0.61)
  Top 0.508: v208.28,48.26 v210.82,50.8 | R147.1 220.98,53.98 220.98,57.78 R148.2 220.98,59.05 220.98,67.94 J2.Y
  Bottom 0.508: v208.28,48.26 203.84,43.81 175.9,43.81 E30.5 | v210.82,50.8 212.09,52.07 219.07,52.07 220.34,53.34 R147.1
BUS_CA_01_L  (via drill 0.61)
  Top 0.508: v203.2,40.01 v200.66,37.47 | v232.41,46.99 240.66,55.24 RN4.3 241.3,57.15 241.3,59.69 RN8.3 241.3,62.23 241.3,67.94 J2.SS
  Bottom 0.508: v200.66,37.47 174.62,37.47 173.35,36.2 E30.3 | v203.2,40.01 210.19,46.99 v232.41,46.99
BUS_CA_02_L
  Top 0.508: RN3.10 215.9,57.15 215.9,59.69 RN7.10 215.9,62.23 215.9,67.94 J2.U
  Bottom 0.508: E31.5 155.57,42.55 156.84,41.27 177.16,41.27 178.44,42.55 204.47,42.55 210.19,48.26 220.34,48.26 222.25,50.16 222.25,54.61 215.9,54.61 RN3.10
BUS_CA_03_L
  Top 0.508: RN4.2 243.84,57.15 243.84,59.69 RN8.2 243.84,62.23 243.84,67.94 J2.UU
  Bottom 0.508: E31.3 153.03,36.2 156.21,39.37 183.51,39.37 184.15,38.73 214.63,38.73 217.17,41.27 229.87,41.27 233.04,44.45 237.49,44.45 247.65,54.61 247.65,57.78 245.75,57.78 244.47,56.52 RN4.2
BUS_CA_04_L  (via drill 0.61)
  Top 0.508: RN4.5 236.22,57.15 236.22,59.69 RN8.5 236.22,62.23 236.22,67.94 J2.MM | v120.65,43.81 122.56,45.72 122.56,64.77 132.08,74.3 v132.08,75.56 | v140.97,82.55 v140.97,78.74 | v242.57,76.2 244.47,74.3 244.47,72.39 245.75,71.12 245.75,67.94 v245.11,67.31
  Bottom 0.508: v120.65,43.81 112.39,43.81 E32.5 | v132.08,75.56 135.25,78.74 v140.97,78.74 | v140.97,82.55 147.96,82.55 149.22,81.28 176.53,81.28 181.61,76.2 v242.57,76.2 | v245.11,67.31 244.47,66.67 238.76,66.67 236.85,68.58 J2.MM
BUS_CA_05_L  (via drill 0.61)
  Top 0.508: RN4.9 226.06,57.15 226.06,59.69 RN8.9 | v114.94,46.35 114.94,43.81 109.22,38.1 109.22,36.83 E32.3 | v117.47,47.62 121.28,51.44 121.28,85.09 123.19,87 v123.19,99.69 | v142.24,103.5 v139.7,106.05 | v158.75,101.6 v158.75,57.78 | v204.47,59.05 v204.47,65.41
  Bottom 0.508: v114.94,46.35 116.2,47.62 v117.47,47.62 | v123.19,99.69 125.09,99.69 125.73,100.33 125.73,106.05 v139.7,106.05 | v142.24,103.5 144.15,101.6 v158.75,101.6 | v158.75,57.78 160.02,59.05 v204.47,59.05 | v204.47,65.41 222.25,65.41 | 222.25,65.41 225.43,68.58 J2.CC | 222.25,65.41 222.88,65.41 226.06,62.23 RN8.9
BUS_CA_06_L  (via drill 0.61)
  Top 0.508: v41.91,59.69 41.91,63.5 38.1,67.31 E33.5 | v111.76,66.04 118.75,59.05 v118.75,50.8 | v220.98,50.8 222.25,49.53 v222.25,48.26 | v234.95,52.07 238.12,55.24 RN4.4 238.76,57.15 238.76,59.69 RN8.4 238.76,62.23 238.76,67.94 J2.PP
  Bottom 0.508: v41.91,59.69 42.55,59.05 56.52,59.05 60.96,63.5 68.58,63.5 71.12,66.04 v111.76,66.04 | v118.75,50.8 136.53,50.8 138.43,48.9 180.97,48.9 182.25,47.62 186.06,47.62 186.69,46.99 196.85,46.99 199.39,49.53 219.71,49.53 v220.98,50.8 | v222.25,48.26 226.06,52.07 v234.95,52.07
BUS_CA_07_L  (via drill 0.61)
  Top 0.508: RN4.7 230.5,56.52 229.87,57.15 229.87,59.69 230.5,60.33 RN8.7 | v127,52.07 127,67.94 133.35,74.3 133.35,84.45 132.08,85.72 v132.08,90.17 | v160.02,90.17 164.47,85.72 173.35,85.72 v173.35,80.01
  Bottom 0.508: v127,52.07 118.11,52.07 116.2,50.16 97.79,50.16 94.61,53.34 41.91,53.34 40.01,51.44 33.66,51.44 33.66,53.98 34.92,55.24 35.56,55.24 35.56,59.69 E33.3 | v132.08,90.17 132.72,90.81 147.32,90.81 148.59,92.08 151.13,92.08 153.03,90.17 v160.02,90.17 | v173.35,80.01 180.34,73.03 243.84,73.03 246.38,70.48 246.38,65.41 234.95,65.41 | 234.95,65.41 231.78,68.58 J2.HH | 234.95,65.41 234.31,65.41 231.14,62.23 RN8.7
BUS_DATA&CLOCK_L  (via drill 0.61)
  Top 0.508: RN4.6 233.68,57.15 233.68,59.69 RN8.6 233.68,62.23 233.68,67.94 J2.KK | v84.45,145.41 85.72,146.69 93.98,146.69 93.98,109.86 88.9,104.78 v88.9,80.64 | v100.33,80.64 105.41,75.56 v105.41,57.78 | v190.5,62.87 192.41,64.77 v192.41,74.93
  Bottom 0.508: v84.45,145.41 50.8,145.41 43.18,137.79 37.47,137.79 36.2,139.06 E9.10 | v100.33,80.64 v88.9,80.64 | v105.41,57.78 156.84,57.78 161.93,62.87 v190.5,62.87 | v192.41,74.93 243.21,74.93 247.65,70.48 247.65,62.87 235.59,62.87 234.31,61.59 RN8.6
BUS_DC_LO_L
  Top 0.508: 240.03,101.6 240.66,101.6 C53.1 | 240.03,101.6 239.4,101.6 R50.1 | 240.03,101.6 240.03,85.72 241.3,84.45 J1.TT
BUS_FILE_READY
  Top 0.508: RN1.9 215.9,95.25 215.9,92.71 RN5.9 215.9,90.17 215.9,84.45 J1.V
BUS_HIGH_DENSITY_L
  Top 0.508: RN1.6 208.28,95.25 208.28,92.71 RN5.6 208.28,90.17 208.28,84.45 J1.N
BUS_INDEX_L  (via drill 0.61)
  Top 0.508: RN2.10 220.98,95.25 220.98,92.71 RN6.10 220.98,90.17 220.98,84.45 J1.Z | 57.78,137.79 55.24,137.79 50.8,133.35 E11.1 | 57.78,137.79 57.78,139.06 E11.11 | v154.94,91.44 154.94,112.39 150.5,116.84 v146.05,116.84 | v107.95,118.11 106.05,120.02 106.05,121.92 105.41,122.56 v105.41,136.53 | v58.42,136.53 57.78,137.16 57.78,137.79
  Bottom 0.508: v154.94,91.44 169.54,91.44 171.45,93.34 219.07,93.34 220.34,92.08 RN6.10 | v146.05,116.84 144.78,118.11 121.92,118.11 120.65,116.84 116.84,116.84 115.57,118.11 v107.95,118.11 | v105.41,136.53 v58.42,136.53
BUS_READ_GATE_L
  Top 0.508: RN1.5 205.74,95.25 205.74,92.71 RN5.5 205.74,90.17 205.74,84.45 J1.L
BUS_RESTORE_L  (via drill 0.61)
  Top 0.508: E22.5 48.26,44.45 48.26,47.62 C34.1 | RN3.8 210.82,57.15 210.82,59.69 RN7.8 210.82,62.23 210.82,67.94 J2.P | v38.1,47.62 38.1,51.44 40.64,53.98 40.64,63.5 36.83,67.31 36.83,76.83 38.1,78.11 38.1,99.69 53.34,114.94 53.34,129.54 54.61,130.81 v54.61,135.25 | v173.99,133.35 176.53,130.81 176.53,100.97 v185.42,92.08 | v189.87,90.81 193.68,87 193.68,62.87 194.31,62.23 v194.31,53.98
  Bottom 0.508: v38.1,47.62 46.99,47.62 47.62,48.26 C34.1 | v54.61,135.25 170.18,135.25 172.09,133.35 v173.99,133.35 | v185.42,92.08 186.69,90.81 v189.87,90.81 | v194.31,53.98 196.22,52.07 208.91,52.07 210.82,53.98 210.82,54.61 RN3.8
BUS_RWS_READY_L  (via drill 0.61)
  Top 0.508: v210.82,7.62 214.63,3.81 232.41,3.81 232.41,45.09 228.6,48.9 228.6,54.61 RN4.8 228.6,57.15 228.6,59.69 RN8.8 228.6,62.23 228.6,67.94 J2.EE
  Bottom 0.508: v210.82,7.62 198.12,7.62 196.22,9.53 E12.5
BUS_SECTOR_ADDR_0L  (via drill 0.61)
  Top 0.508: R17.1 137.16,127.64 137.16,130.81 E6.5 | J1.DD 226.06,84.45 226.06,90.17 RN6.8 226.06,92.71 226.06,95.25 RN2.8 226.06,97.79 226.06,98.42 194.94,98.42 194.31,97.79 189.87,97.79 189.23,98.42 189.23,123.83 v186.06,127
  Bottom 0.508: v186.06,127 137.79,127 R17.1
BUS_SECTOR_ADDR_1L  (via drill 0.61)
  Top 0.508: RN3.6 205.74,57.15 205.74,59.69 RN7.6 205.74,62.23 205.74,67.94 J2.K | E6.13 129.54,138.43 130.81,137.16 130.81,130.18 v129.54,128.91 133.35,125.09 133.35,113.67 v134.62,112.39 | v185.42,57.78 184.78,58.42 184.78,88.27 173.99,99.06 v173.99,113.03
  Bottom 0.508: v129.54,128.91 123.19,128.91 122.56,129.54 R18.1 | v185.42,57.78 203.84,57.78 205.1,56.52 RN3.6 | v173.99,113.03 167,113.03 166.37,112.39 v134.62,112.39
BUS_SECTOR_ADDR_2L  (via drill 0.61)
  Top 0.508: E6.11 134.62,140.97 137.16,143.51 137.16,146.69 R16.1 | J1.FF 228.6,84.45 228.6,90.17 RN6.7 228.6,92.71 228.6,95.25 RN2.7 228.6,97.79 227.33,99.06 227.33,103.5 224.16,106.68 224.16,120.65 224.79,121.28 224.79,149.86 160.02,149.86 v158.75,148.59
  Bottom 0.508: v158.75,148.59 139.06,148.59 137.79,147.32 R16.1
BUS_SECTOR_ADDR_3L
  Top 0.508: E6.9 139.7,140.97 139.7,144.15 R11.1 | RN2.5 233.68,95.25 233.68,92.71 RN6.5 233.68,90.17 233.68,84.45 J1.LL
  Bottom 0.508: R11.1 139.06,144.78 137.79,146.05 136.53,146.05 135.89,146.69 135.89,149.86 238.76,149.86 247.65,140.97 247.65,85.72 236.22,85.72 234.31,83.82 J1.LL
BUS_SECTOR_PULSE_L
  Top 0.508: RN1.8 213.36,95.25 213.36,92.71 RN5.8 213.36,90.17 213.36,84.45 J1.T
BUS_SEEK_INCOMPLETE_L  (via drill 0.61)
  Top 0.508: J2.E 200.66,67.94 200.66,62.23 RN7.4 200.66,59.69 200.66,57.15 RN3.4 200.66,54.61 200.03,53.98 200.03,45.09 192.41,37.47 192.41,34.92 v186.06,28.57 | v146.69,28.57 v143.51,31.75 | v129.54,32.38 128.27,33.66 128.27,40.64 128.91,41.27 128.91,46.99 128.27,47.62 v128.27,62.87 | v116.84,62.87 109.22,70.48 v109.22,71.75
  Bottom 0.508: 66.04,69.85 64.14,71.75 53.98,71.75 51.44,69.22 E21.7 | 66.04,69.85 66.04,69.22 R27.1 | v186.06,28.57 v146.69,28.57 | v143.51,31.75 135.89,31.75 135.25,32.38 v129.54,32.38 | v128.27,62.87 v116.84,62.87 | v109.22,71.75 108.58,72.39 72.39,72.39 71.75,73.03 69.22,73.03 66.04,69.85
BUS_STROBE_L  (via drill 0.61)
  Top 0.508: v52.07,99.06 52.07,46.35 50.8,45.09 50.8,38.1 48.26,38.1 46.35,36.2 E22.3 | v82.55,107.31 87.63,107.31 v87.63,76.2 | v108.58,76.2 111.12,78.74 118.75,78.74 v118.75,77.47 | v146.05,71.75 147.96,69.85 147.96,65.41 151.13,62.23 151.13,59.69 151.76,59.05 153.67,59.05 153.67,67.31 157.48,71.12 v157.48,76.2 | v172.72,76.83 177.16,81.28 v177.16,86.36 | RN2.3 238.12,95.89 237.49,95.25 237.49,92.71 238.12,92.08 RN6.3 238.76,90.17 238.76,84.45 J1.RR
  Bottom 0.508: v52.07,99.06 52.07,107.31 v82.55,107.31 | v108.58,76.2 v87.63,76.2 | v118.75,77.47 125.09,71.12 135.89,71.12 136.53,71.75 v146.05,71.75 | v157.48,76.2 158.12,76.83 v172.72,76.83 | v177.16,86.36 180.34,89.53 236.85,89.53 238.12,90.81 RN6.3
BUS_WP_SET_L
  Top 0.508: RN1.4 203.2,95.25 203.2,92.71 RN5.4 203.2,90.17 203.2,84.45 J1.J
BUS_WP_STATUS_L
  Top 0.508: RN1.7 210.82,95.25 210.82,92.71 RN5.7 210.82,90.17 210.82,84.45 J1.R
BUS_WRITE_CK
  Top 0.508: RN2.6 231.14,95.25 231.14,92.71 RN6.6 231.14,90.17 231.14,84.45 J1.JJ
BUS_WRITE_GATE_L  (via drill 0.61)
  Top 0.508: v133.35,146.69 137.79,151.13 237.49,151.13 237.49,126.36 236.22,125.09 v236.22,108.58 | RN2.9 223.52,95.25 223.52,92.71 RN6.9 223.52,90.17 223.52,84.45 J1.BB
  Bottom 0.508: v133.35,146.69 129.54,142.88 128.91,142.88 128.27,142.24 125.09,142.24 120.65,146.69 34.92,146.69 28.57,140.34 E9.13 | v236.22,108.58 230.5,102.87 227.33,102.87 223.52,99.06 223.52,97.79 RN2.9
CA_SW_1
  Bottom 0.508: E26.9 83.82,102.87 83.82,107.31 113.67,107.31 115.57,109.22 118.11,109.22 CYL1.3 120.65,109.22 126.36,109.22 R45.2
CA_SW_2  (via drill 0.61)
  Top 0.508: v77.47,110.49 77.47,109.86 74.93,107.31 74.93,102.87 75.56,102.23 E26.12
  Bottom 0.508: v77.47,110.49 78.74,111.76 100.97,111.76 102.87,109.86 CYL2.3 105.41,109.22 111.12,109.22 R44.2
CA_SW_4  (via drill 0.61)
  Top 0.508: v147.96,80.64 147.96,77.47 149.22,76.2 149.22,65.41 152.4,62.23 E27.9 | v109.22,78.74 97.79,90.17 97.79,95.25 102.87,100.33 102.87,106.68 v100.97,108.58
  Bottom 0.508: v147.96,80.64 147.32,81.28 120.02,81.28 117.47,78.74 v109.22,78.74 | v100.97,108.58 100.33,109.22 97.16,109.22 R43.2 95.89,109.22 90.17,109.22 CYL4.3
CA_SW_8  (via drill 0.61)
  Top 0.508: v144.78,77.47 144.78,62.23 E27.12 | v132.08,80.01 125.73,86.36 v125.73,90.17 | v84.45,90.81 82.55,92.71 82.55,105.41 81.28,106.68 81.28,108.58 R42.2
  Bottom 0.508: v144.78,77.47 142.24,80.01 v132.08,80.01 | v125.73,90.17 125.09,90.81 v84.45,90.81 | CYL8.3 74.93,109.22 80.64,109.22 R42.2
CA_SW_16  (via drill 0.61)
  Top 0.508: v109.22,64.14 109.22,63.5 111.12,61.59 E28.9 | v91.44,64.77 89.53,66.67 v89.53,71.12 | v77.47,71.12 76.83,71.75 v76.83,89.53 | v64.77,89.53 65.41,90.17 65.41,109.22 | 65.41,109.22 R41.2 65.41,109.22 | 65.41,109.22 59.69,109.22 CYL16.3
  Bottom 0.508: v109.22,64.14 108.58,64.77 v91.44,64.77 | v77.47,71.12 v89.53,71.12 | v76.83,89.53 v64.77,89.53
CA_SW_32  (via drill 0.61)
  Top 0.508: v97.79,69.85 97.79,67.31 103.5,61.59 E28.12 | v88.27,69.85 87.63,70.48 v87.63,73.66 | v63.5,80.01 63.5,99.69 53.98,109.22 51.44,109.22 R40.2
  Bottom 0.508: R40.2 50.16,109.22 44.45,109.22 CYL32.3 | v88.27,69.85 v97.79,69.85 | v87.63,73.66 85.09,76.2 67.94,76.2 64.14,80.01 v63.5,80.01
CA_SW_64  (via drill 0.61)
  Top 0.508: v82.55,41.27 82.55,45.09 78.74,48.9 78.74,80.64 78.11,81.28 v78.11,90.17 | v35.56,95.25 35.56,108.58 R39.2
  Bottom 0.508: v82.55,41.27 83.82,40.01 90.81,40.01 93.34,42.55 E29.9 | v78.11,90.17 77.47,90.81 60.96,90.81 56.52,95.25 v35.56,95.25 | CYL64.3 29.21,109.22 34.92,109.22 R39.2
CA_SW_128  (via drill 0.61)
  Top 0.508: v83.82,73.66 83.82,46.99 86.36,44.45 E29.12 | v67.94,92.08 v67.94,74.93
  Bottom 0.508: CYL128.3 13.97,109.22 19.68,109.22 R38.2 20.95,109.22 23.5,109.22 36.2,96.52 61.59,96.52 65.41,92.71 67.31,92.71 v67.94,92.08 | v83.82,73.66 82.55,74.93 v67.94,74.93
CLOCK_H  (via drill 0.61)
  Top 0.508: v109.22,110.49 105.41,106.68 105.41,102.87 106.05,102.23 E7.10 | v134.62,125.73 v134.62,116.84 | v149.86,125.73 152.4,128.27 152.4,130.81 E8.1
  Bottom 0.508: E7.12 102.23,100.97 103.5,99.69 104.78,99.69 106.05,100.97 E7.10 | E8.1 153.03,131.44 154.31,130.18 160.66,130.18 161.93,131.44 E8.5 | v109.22,110.49 111.12,112.39 120.65,112.39 125.09,116.84 v134.62,116.84 | v134.62,125.73 v149.86,125.73
CONSTANT_WRITE_L  (via drill 0.61)
  Top 0.508: v59.69,144.15 59.69,134.62 58.42,133.35 E11.4 | v116.84,144.15 120.65,140.34 120.65,128.91 125.73,123.83 v125.73,123.19 | v129.54,119.38 130.81,118.11 v130.81,114.3
  Bottom 0.508: v116.84,144.15 v59.69,144.15 | v125.73,123.19 v129.54,119.38 | v130.81,114.3 148.59,114.3 CW.2
DATA_BITS
  Top 0.508: R7.1 217.81,109.22 212.09,109.22 BIT1.3
  Bottom 0.508: BIT0.3 196.85,109.22 209.55,109.22 BIT1.3 | R7.1 219.07,109.22 224.79,109.22 BIT2.3 226.69,110.49 239.4,110.49 240.03,109.86 BIT3.3
DC_ERASE  (via drill 0.61)
  Top 0.508: v154.94,114.94 154.94,118.75 146.05,127.64 146.05,148.59 136.53,148.59 134.62,146.69 134.62,142.24 125.09,142.24 121.92,145.41 121.92,151.13 50.16,151.13 44.45,145.41 44.45,144.78 40.64,140.97 E9.8
  Bottom 0.508: v154.94,114.94 163.83,114.94 DC_ERASE.2
FWD_L  (via drill 0.61)
  Top 0.508: v50.8,80.01 50.8,85.72 R36.1 | v57.78,54.61 57.15,55.24 57.15,77.47 57.78,78.11 FWD/REV.3 | v72.39,54.61 76.2,50.8 v76.2,27.94 | v109.22,27.94 109.22,19.05 E17.9
  Bottom 0.508: v50.8,80.01 51.44,79.38 57.15,79.38 FWD/REV.3 | E17.9 109.86,18.41 111.12,19.68 113.03,19.68 115.57,17.14 130.81,17.14 132.08,15.88 145.41,15.88 146.69,17.14 E16.9 | v72.39,54.61 v57.78,54.61 | v76.2,27.94 v109.22,27.94
GND  (via drill 0.61)
  Top 0.508: v190.5,53.98 191.77,55.24 191.77,58.42 193.04,59.69 RN7.1 192.41,60.96 191.13,60.96 C40.2 | RN8.1 247.01,60.96 248.28,60.96 C41.2 248.92,60.33 250.19,59.05 250.19,52.7 243.84,46.35 R23.1 243.84,45.09 245.11,43.81 245.11,22.86 | C14.2 207.65,10.16 201.29,10.16 E12.7 200.66,11.43 200.66,13.97 198.12,16.51 E12.9 198.12,19.05 198.12,29.84 SECTOR.11 197.49,29.84 193.68,29.84 193.68,27.94 SECTOR.12 | 245.11,22.86 245.11,12.7 246.38,11.43 E13.4 245.75,9.53 244.47,8.26 236.22,8.26 236.22,9.53 C13.2 | 245.11,22.86 D5.A 245.11,22.86 | E14.8 228.6,11.43 228.6,16.51 E14.9 | J2.B 196.22,71.12 197.49,71.12 J2.D 198.75,71.12 200.03,71.12 J2.F 201.29,71.12 202.56,71.12 J2.J 203.84,71.12 205.1,71.12 J2.L 206.38,71.12 207.65,71.12 J2.N 208.91,71.12 210.19,71.12 J2.R 211.46,71.12 212.72,71.12 J2.T 214,71.12 215.26,71.12 J2.V 216.53,71.12 217.81,71.12 J2.X 219.07,71.12 220.34,71.12 J2.Z 221.62,71.12 222.88,71.12 J2.BB 224.16,71.12 225.43,71.12 J2.DD 226.69,71.12 227.97,71.12 J2.FF 229.24,71.12 230.5,71.12 J2.JJ 231.78,71.12 233.04,71.12 J2.LL 234.31,71.12 235.59,71.12 J2.NN 236.85,71.12 238.12,71.12 J2.RR 239.4,71.12 240.66,71.12 J2.TT | J2.VV 243.21,71.12 241.94,71.12 J2.TT | C42.2 193.68,91.44 194.94,91.44 RN5.1 195.58,90.17 195.58,84.45 J1.B 195.58,83.19 195.58,81.92 J1.A 196.22,81.28 197.49,81.28 J1.C 198.75,81.28 200.03,81.28 J1.E 201.29,81.28 202.56,81.28 J1.H 203.84,81.28 205.1,81.28 J1.K 206.38,81.28 207.65,81.28 J1.M 208.91,81.28 210.19,81.28 J1.P 211.46,81.28 212.72,81.28 J1.S 214,81.28 215.26,81.28 J1.U 216.53,81.28 217.81,81.28 J1.W 219.07,81.28 220.34,81.28 J1.Y 221.62,81.28 222.88,81.28 J1.AA 224.16,81.28 225.43,81.28 J1.CC 226.69,81.28 227.97,81.28 J1.EE 229.24,81.28 230.5,81.28 J1.HH 231.78,81.28 233.04,81.28 J1.KK 234.31,81.28 235.59,81.28 J1.MM 236.85,81.28 238.12,81.28 J1.PP 239.4,81.28 240.66,81.28 J1.SS
  Top 0.508: J1.SS 241.94,81.28 243.21,81.28 J1.UU 243.84,81.92 245.75,83.82 245.75,88.27 243.84,90.17 RN6.1 244.47,91.44 245.75,91.44 C43.2 246.38,92.08 247.65,93.34 247.65,99.69 246.38,100.97 C53.2 246.38,102.23 246.38,113.67 241.94,118.11 BIT3.1 241.94,120.02 241.94,126.36 246.38,130.81 E1.7 | J2.TT 241.3,71.75 241.3,80.64 J1.SS | v187.96,61.59 187.96,67.94 C52.- | C1.2 228.6,131.44 226.69,129.54 226.69,120.02 BIT2.1 | C2.2 202.56,132.08 196.22,132.08 E4.7 195.58,130.81 195.58,120.02 BIT0.1 | C61.- 151.76,69.22 150.5,70.48 150.5,78.11 HEAD.3 150.5,80.01 151.76,81.28 151.76,91.44 150.5,92.71 150.5,108.58 CW.3 | E8.8 170.18,133.35 170.18,138.43 E8.9 | C4.2 177.8,131.44 177.8,122.56 182.88,117.47 R15.1 | E9.2 28.57,131.44 29.84,131.44 E9.3 31.11,131.44 32.38,130.18 34.92,130.18 34.92,131.44 E9.5 | E9.7 40.01,131.44 38.73,131.44 E9.6 | 22.86,108.58 22.86,99.69 C60.- | 22.86,108.58 27.3,113.03 CYL64.2 | 22.86,108.58 22.86,131.44 C9.2 | E5.2 127.64,93.34 128.91,93.34 E5.3 | E7.7 111.76,92.71 114.3,90.17 114.3,87.63 POWER.1 | E24.10 111.76,138.43 111.76,134.62 113.03,133.35 113.03,122.56 117.47,118.11 117.47,116.84 118.75,115.57 CYL1.2 120.02,113.03 121.28,111.76 121.28,107.95 120.65,107.31 120.65,95.89 121.92,94.61 C5.2 | E24.12 106.05,139.06 104.78,139.06 E24.13 104.14,138.43 99.06,133.35 99.06,132.72 C24.2 | C10.2 73.66,131.44 74.93,130.18 74.93,121.28 75.56,120.65 75.56,116.84 74.3,115.57 CYL8.2 | E10.7 91.44,130.81 90.17,129.54 90.17,121.28 90.81,120.65 90.81,116.84 89.53,115.57 CYL4.2 | C34.2 47.62,55.88 45.72,57.78 45.72,60.33 C21.2 45.72,61.59 44.45,62.87 44.45,75.56 45.09,76.2 45.09,81.28 43.81,82.55 RTZ.2
  Top 0.508: C20.2 13.34,10.16 14.61,10.16 E20.1 15.24,11.43 17.78,13.97 17.78,16.51 E20.15 | E19.10 58.42,16.51 60.96,13.97 60.96,11.43 E19.8 | E22.4 48.26,34.29 45.72,31.75 45.72,19.05 E19.15 | C68.- 36.2,52.7 36.83,52.07 36.83,41.91 38.1,40.64 38.1,36.2 C22.2 | v114.94,13.34 112.39,10.79 E17.7 | E16.7 150.5,10.16 156.84,10.16 C15.2 | E15.13 163.19,17.14 164.47,17.14 E15.12 165.1,19.05 165.1,34.92 C30.2 | E15.4 168.28,9.53 169.54,9.53 E15.5 170.81,10.79 173.35,13.34 | E15.10 170.81,17.14 172.09,17.14 E15.9 | 173.35,13.34 172.72,13.97 172.72,16.51 E15.9 | 173.35,13.34 175.26,11.43 E15.7 175.9,10.16 182.25,10.16 C12.2 | E30.4 175.26,34.29 172.72,31.75 172.72,19.05 E15.9 | E27.7 154.94,52.07 156.21,50.8 156.21,38.1 154.94,36.83 E31.4 | E26.7 86.36,92.71 86.36,64.14 C67.- 87,62.87 91.44,58.42 v91.44,55.88 | C17.2 93.98,10.79 92.71,12.06 92.71,29.21 96.52,33.02 96.52,34.29 E29.7 | E28.7 114.3,52.07 116.2,50.16 116.2,43.81 123.83,36.2 FUNCTION.A | POWER_ON.B 98.42,85.72 96.52,83.82 96.52,62.87 95.25,61.59 95.25,55.24 96.52,53.98 C28.2 | WRITE.2 164.47,82.55 163.19,81.28 163.19,76.2 163.83,75.56 163.83,55.24 162.56,53.98 C3.2
  Bottom 0.508: v190.5,53.98 183.51,53.98 E3.8 | RN8.1 245.75,60.33 243.84,58.42 231.78,58.42 R148.1 230.5,58.42 223.52,58.42 222.25,59.69 217.81,59.69 217.17,59.05 209.55,59.05 208.91,58.42 R70.1 208.28,59.05 207.01,59.05 207.01,62.23 206.38,62.87 194.94,62.87 193.68,61.59 RN7.1 | E14.1 210.19,10.16 208.91,10.16 C14.2 | SECTOR.12 194.31,27.3 207.01,27.3 207.65,27.94 C38.2 208.91,27.94 210.19,26.67 221.62,26.67 222.88,25.4 R31.1 223.52,24.77 228.6,19.68 228.6,19.05 E14.9 | R23.1 243.21,45.72 239.4,41.91 233.04,41.91 231.78,40.64 C36.2 | C13.2 235.59,10.16 229.24,10.16 E14.8 | C44.- 180.97,67.94 187.32,67.94 C52.- 188.59,69.22 190.5,71.12 194.94,71.12 J2.B | RN6.1 243.21,90.81 241.94,90.81 RN6.2 241.3,92.71 240.66,92.71 239.4,93.98 C39.2 | WRITE.2 166.37,83.19 174.62,83.19 C45.+ 175.9,83.19 179.07,80.01 193.68,80.01 194.94,81.28 J1.A | v187.96,61.59 189.23,61.59 189.87,60.96 C40.2 | E2.7 221.62,132.08 227.97,132.08 C1.2 | BIT3.1 240.03,118.75 239.4,118.11 226.69,118.11 BIT2.1 224.79,118.75 224.16,118.11 211.46,118.11 BIT1.1 209.55,118.75 196.85,118.75 BIT0.1 194.31,118.75 192.41,116.84 183.51,116.84 R15.1 182.25,116.84 177.16,111.76 173.35,111.76 R14.1 172.09,111.76 170.18,109.86 166.37,109.86 DC_ERASE.3 163.83,109.22 151.13,109.22 CW.3 | E24.7 117.47,132.08 123.83,132.08 C6.2 125.09,132.08 126.36,132.08 E6.1 127.64,131.44 128.91,130.18 140.34,130.18 141.6,131.44 E6.7 142.88,132.08 149.22,132.08 C8.2 149.86,132.72 151.13,133.99 168.28,133.99 169.54,132.72 E8.8 170.81,132.08 177.16,132.08 C4.2 | C9.2 22.86,131.44 24.13,130.18 26.04,130.18 27.3,131.44 E9.2
  Bottom 0.508: E9.5 36.2,131.44 37.47,131.44 E9.6 | C11.2 47.62,132.08 41.27,132.08 E9.7 | CYL128.2 13.97,113.67 26.67,113.67 CYL64.2 29.21,113.67 41.91,113.67 CYL32.2 44.45,113.67 57.15,113.67 CYL16.2 59.69,113.67 72.39,113.67 CYL8.2 74.93,113.67 87.63,113.67 CYL4.2 90.17,113.67 102.87,113.67 CYL2.2 105.41,113.67 118.11,113.67 CYL1.2 | E5.7 139.06,93.34 137.79,92.08 131.44,92.08 130.18,93.34 E5.3 | E7.7 112.39,93.98 121.28,93.98 C5.2 121.92,93.34 123.19,92.08 125.09,92.08 126.36,93.34 E5.2 | POWER_ON.B 99.69,85.72 111.12,85.72 POWER.1 | E24.10 112.39,139.06 113.67,139.06 E24.9 | E10.7 92.08,132.08 98.42,132.08 C24.2 | E11.7 66.67,132.08 73.03,132.08 C10.2 | RTZ.2 44.45,83.19 57.15,83.19 FWD/REV.2 | E21.4 55.24,61.59 53.98,62.87 46.99,62.87 45.72,61.59 C21.2 45.09,60.96 38.73,60.96 E33.4 37.47,61.59 36.2,62.87 27.94,62.87 27.94,67.94 C33.2 | C68.- 36.2,53.98 38.1,55.88 47.62,55.88 C34.2 | E20.15 17.78,19.05 17.78,31.75 15.88,31.75 12.7,34.92 C23.2 12.7,36.2 13.97,37.47 28.57,37.47 29.84,36.2 E23.7 31.11,35.56 37.47,35.56 C22.2 38.1,36.2 39.37,37.47 46.35,37.47 47.62,36.2 E22.4 48.26,36.83 58.42,36.83 59.69,35.56 DRIVE.A 61.59,35.56 62.87,36.83 76.83,36.83 78.11,35.56 C29.2 78.74,36.2 79.38,36.83 80.01,36.83 80.64,37.47 102.87,37.47 | E19.8 61.59,10.16 67.94,10.16 C18.2 | 39.37,10.16 40.01,10.16 C19.2 | 39.37,10.16 33.66,10.16 E20.8 | 45.09,15.88 39.37,10.16 | 45.09,15.88 45.72,16.51 E19.15 | 45.09,15.88 56.52,15.88 57.78,17.14 E19.10 | C3.2 161.93,53.34 155.57,53.34 E27.7 154.31,53.98 153.03,55.24 138.43,55.24 137.16,53.98 C27.2 | v114.94,13.34 128.27,13.34 131.44,10.16 C16.2 132.08,10.79 133.35,12.06 147.96,12.06 149.22,10.79 E16.7
  Bottom 0.508: C30.2 164.47,35.56 155.57,35.56 E31.4 154.31,34.92 153.03,33.66 146.05,33.66 144.78,34.92 C31.2 144.15,35.56 142.88,36.83 121.92,36.83 | E15.12 165.74,18.41 167,19.68 168.28,19.68 169.54,18.41 E15.10 | C15.2 157.48,9.53 158.75,8.26 165.74,8.26 167,9.53 E15.4 | C7.2 93.34,93.98 87,93.98 E26.7 85.72,93.34 84.45,92.08 69.85,92.08 68.58,93.34 C26.2 | 97.16,54.61 96.52,53.98 C28.2 | 97.16,54.61 97.79,55.24 112.39,55.24 113.67,53.98 E28.7 | E18.7 87,10.16 93.34,10.16 C17.2 | E29.7 97.16,35.56 100.97,35.56 C32.2 101.6,36.2 102.87,37.47 | 102.87,37.47 109.86,37.47 111.12,36.2 E32.4 111.76,36.83 121.92,36.83 | 121.92,36.83 123.19,35.56 FUNCTION.A | v91.44,55.88 92.71,54.61 97.16,54.61
HEAD_SELECT_L  (via drill 0.61)
  Top 0.508: RN1.10 218.44,95.25 218.44,92.71 RN5.10 218.44,90.17 218.44,84.45 J1.X | v149.22,97.79 149.22,92.71 147.96,91.44 147.96,86.36 149.22,85.09 HEAD.2
  Bottom 0.508: v149.22,97.79 187.32,97.79 189.87,100.33 214.63,100.33 217.81,97.16 RN1.10
N$1  (via drill 0.61)
  Top 0.508: v203.2,5.08 198.75,9.53 E12.6
  Bottom 0.508: v203.2,5.08 214,5.08 217.17,8.26 236.85,8.26 238.12,9.53 E13.1
N$2  (via drill 0.61)
  Top 0.508: v112.39,121.28 113.67,120.02 v113.67,92.71
  Bottom 0.508: v112.39,121.28 106.68,121.28 102.23,125.73 31.75,125.73 31.75,140.97 32.38,141.6 36.2,141.6 37.47,140.34 E9.9 | v113.67,92.71 113.03,92.08 111.12,92.08 109.86,93.34 E7.6
N$3
  Top 0.508: E11.13 53.98,139.06 55.24,139.06 E11.12 | E10.13 79.38,139.06 80.64,137.79 90.81,137.79 90.81,139.06 E10.8
  Bottom 0.508: E11.13 52.7,139.06 51.44,137.79 50.16,137.79 49.53,138.43 49.53,142.88 75.56,142.88 78.11,140.34 E10.13
N$4
  Top 0.508: E10.11 84.45,139.06 85.72,139.06 E10.10
N$5  (via drill 0.61)
  Top 0.508: R10.1 215.9,144.15 215.9,140.97 E2.10 215.9,138.43 213.36,135.89 213.36,133.35 E2.4 213.36,130.81 213.36,126.36 v203.84,116.84 | v137.16,104.78 137.16,104.14 135.25,102.23 E5.10
  Bottom 0.508: v137.16,104.78 143.51,104.78 145.41,102.87 180.97,102.87 194.94,116.84 v203.84,116.84
N$6
  Top 0.508: E7.4 104.14,95.25 104.14,100.33 E7.11
N$7  (via drill 0.61)
  Top 0.508: v114.94,95.89 v114.94,100.97
  Bottom 0.508: v114.94,95.89 108.58,95.89 107.31,94.61 E7.5 | v114.94,100.97 112.39,100.97 E7.8
N$8
  Top 0.508: E11.3 56.52,131.44 57.78,130.18 62.23,130.18 62.23,137.16 63.5,138.43 E11.9
N$9  (via drill 0.61)
  Top 0.508: v129.54,107.31 132.08,109.86 v132.08,119.38 | v194.31,128.91 194.31,137.16 195.58,138.43 E4.8
  Bottom 0.508: v129.54,107.31 114.94,107.31 109.86,102.23 E7.9 | v132.08,119.38 132.72,120.02 140.97,120.02 142.88,121.92 187.32,121.92 v194.31,128.91
N$10
  Top 0.508: R20.1 238.76,38.73 238.76,40.01 C36.1 | E13.3 243.84,11.43 242.57,12.7 242.57,39.37 Q1.E
  Bottom 0.508: R20.1 239.4,38.1 240.66,39.37 241.3,39.37 Q1.E
N$11
  Top 0.508: E8.14 157.48,140.97 157.48,145.41 160.66,148.59 170.18,148.59 170.18,142.24 172.72,139.7 172.72,135.25 C63.2
N$12
  Top 0.508: E8.6 165.1,133.35 165.1,137.16 163.83,138.43 163.83,141.6 160.66,144.78 C62.2
N$13  (via drill 0.61)
  Top 0.508: R9.S 181.61,144.78 184.15,147.32 R9.E | v156.21,142.88 156.21,142.24 154.94,140.97 E8.15
  Bottom 0.508: v156.21,142.88 172.72,142.88 C63.1 173.35,142.24 176.53,142.24 179.07,144.78 R9.S
N$14
  Top 0.508: E8.7 167.64,133.35 166.37,134.62 166.37,142.88 167.64,144.15 C62.1 167.64,145.41 167.64,146.69 R8.1
N$15  (via drill 0.61)
  Top 0.508: v70.48,97.79 72.39,95.89 v72.39,88.27 | v100.33,89.53 101.6,90.81 101.6,92.71 E7.3
  Bottom 0.508: v70.48,97.79 50.16,97.79 36.2,111.76 10.79,111.76 10.79,121.92 22.23,133.35 24.13,133.35 29.84,139.06 E9.12 | v72.39,88.27 89.53,88.27 90.81,89.53 v100.33,89.53
N$16
  Top 0.508: R21.1 243.84,36.2 243.84,37.47 Q1.B1
N$17
  Top 0.508: Q1.B2 243.84,41.27 243.84,42.55 R22.2
N$18  (via drill 0.61)
  Top 0.508: R22.1 233.68,43.81 233.68,45.09 R23.2 | E12.13 187.96,19.05 185.42,21.59 185.42,22.23 C37.2 | v205.74,40.01 205.74,33.66 199.39,27.3 v199.39,24.13
  Bottom 0.508: v205.74,40.01 210.82,45.09 232.41,45.09 233.04,45.72 R23.2 | v199.39,24.13 196.22,20.95 191.13,20.95 188.59,18.41 E12.13
N$19  (via drill 0.61)
  Top 0.508: E14.2 214,10.79 219.71,16.51 219.71,19.68 222.25,22.23 222.25,23.5 222.88,24.13 226.06,24.13 226.06,19.05 E14.10 | v41.91,22.86 41.91,33.02 40.64,34.29 E22.1 | E12.12 190.5,19.05 193.04,21.59 193.04,22.23 C37.1
  Bottom 0.508: v41.91,22.86 42.55,22.23 118.11,22.23 118.75,22.86 118.75,24.13 191.13,24.13 192.41,22.86 C37.1 | E14.10 225.43,18.41 222.25,21.59 198.12,21.59 196.22,19.68 192.41,19.68 191.13,18.41 E12.12
N$20
  Top 0.508: E17.1 96.52,8.89 97.79,7.62 97.79,6.35 100.33,3.81 108.58,3.81 108.58,9.53 E17.6
N$21  (via drill 0.61)
  Top 0.508: E17.4 103.5,9.53 102.23,9.53 E17.3 101.6,11.43 100.33,12.7 100.33,24.13 v97.79,26.67 | v48.26,57.78 48.26,59.69 E21.1 | v53.34,57.15 57.78,52.7 v57.78,31.11 | v67.94,30.48 v71.12,27.3
  Bottom 0.508: v48.26,57.78 48.9,57.15 v53.34,57.15 | v57.78,31.11 58.42,30.48 v67.94,30.48 | v71.12,27.3 71.75,26.67 v97.79,26.67
N$22
  Top 0.508: E14.15 213.36,19.05 213.36,22.23 C35.1